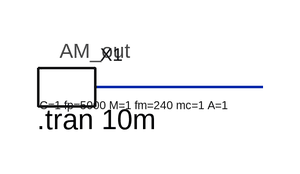
[diagram p0: schematic Test.asc]
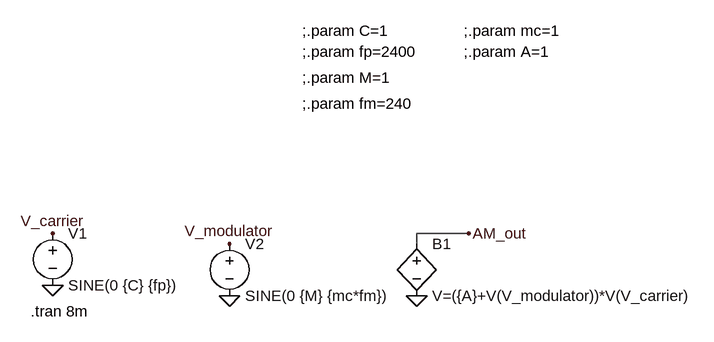
[diagram p1: sub-circuit am_generator.asc]
Test.asc, the LTspice schematic file:
Version 4
SHEET 1 880 680
WIRE 240 112 96 112
SYMBOL AM_GENERATOR 48 128 R0
WINDOW 39 0 0 Left 0
SYMATTR InstName X1
SYMATTR SpiceLine C=1 fp=5000 M=1 fm=240 mc=1 A=1
TEXT 46 140 Left 2 !.tran 10m

am_generator.asc, the sub-circuit schematic file:
Version 4
SHEET 1 984 680
WIRE 576 112 496 112
WIRE 496 128 496 112
FLAG 496 208 0
FLAG 208 208 0
FLAG -64 192 0
FLAG 576 112 AM_out
FLAG -64 112 V_carrier
FLAG 208 128 V_modulator
SYMBOL voltage -64 96 R0
WINDOW 123 0 0 Left 0
WINDOW 39 0 0 Left 0
SYMATTR InstName V1
SYMATTR Value SINE(0 {C} {fp})
SYMBOL voltage 208 112 R0
WINDOW 123 0 0 Left 0
WINDOW 39 0 0 Left 0
SYMATTR InstName V2
SYMATTR Value SINE(0 {M} {mc*fm})
SYMBOL bv 496 112 R0
SYMATTR InstName B1
SYMATTR Value V=({A}+V(V_modulator))*V(V_carrier)
TEXT 320 -200 Left 2 !;.param C=1
TEXT 320 -168 Left 2 !;.param fp=2400
TEXT 320 -128 Left 2 !;.param M=1
TEXT 320 -88 Left 2 !;.param fm=240
TEXT 568 -168 Left 2 !;.param A=1
TEXT 568 -200 Left 2 !;.param mc=1
TEXT -98 232 Left 2 !.tran 8m

The netlist it stands for:
* Test.asc
XX1 N001 am_generator params: C=1 fp=5000 M=1 fm=240 mc=1 A=1

* block symbol definitions
.subckt am_generator AM_out
V1 V_carrier 0 SINE(0 {C} {fp})
V2 V_modulator 0 SINE(0 {M} {mc*fm})
B1 AM_out 0 V=({A}+V(V_modulator))*V(V_carrier)
;.param C=1
;.param fp=2400
;.param M=1
;.param fm=240
;.param A=1
;.param mc=1
.tran 8m
.ends am_generator

.tran 10m
.backanno
.end